# EAGLE design Narrow AAA sensor v1 (EAGLE 7.7.0)
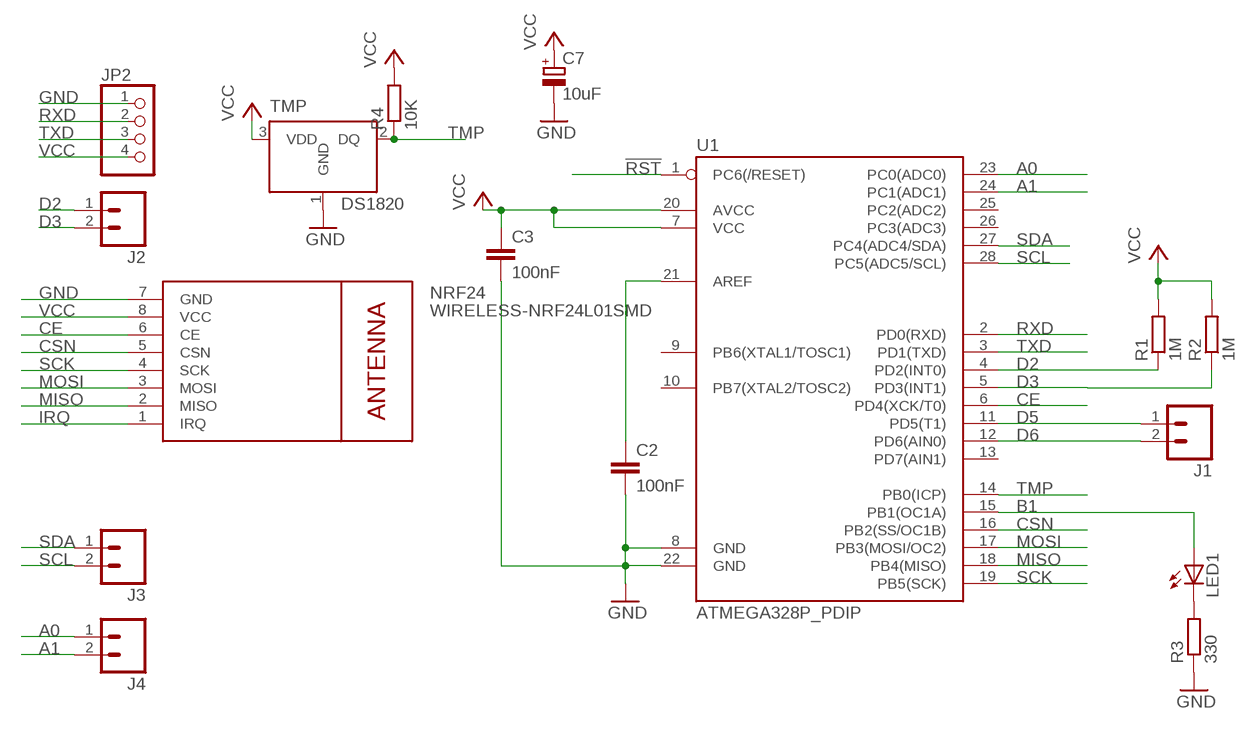
[diagram p0: schematic, sheet 1]

## Parts
C2  100nF  C-EU025-025X050  [C025-025X050]
C3  100nF  C-EU025-025X050  [C025-025X050]
C7  10uF  CPOL-EUE2.5-5  [E2,5-5]
J1  M02PTH  [1X02]
J2  M02PTH  [1X02]
J3  M021X02_NO_SILK  [1X02_NO_SILK]
J4  M021X02_NO_SILK  [1X02_NO_SILK]
JP2  PINHD-1X4  [1X04]
LED1  LED3MM  [LED3MM]
NRF24  WIRELESS-NRF24L01SMD  [WIRELESS-NRF24L01-SMD]
R1  1M  R-EU_0204/7  [0204/7]
R2  1M  R-EU_0204/7  [0204/7]
R3  330  R-EU_0204/7  [0204/7]
R4  10K  R-EU_0204/7  [0204/7]
TMP  DS1820  [TO-92]
U1  ATMEGA328P_PDIP  [DIL28-3]

## Nets
!RST: U1.1(PC6(/RESET))
A0: J4.1 U1.23(PC0(ADC0))
A1: J4.2 U1.24(PC1(ADC1))
B1: LED1.A U1.15(PB1(OC1A))
CE: NRF24.6(CE) U1.6(PD4(XCK/T0))
CSN: NRF24.5(CSN) U1.16(PB2(SS/OC1B))
D2: J2.1 R1.1 U1.4(PD2(INT0))
D3: J2.2 R2.1 U1.5(PD3(INT1))
D5: J1.1 U1.11(PD5(T1))
D6: J1.2 U1.12(PD6(AIN0))
GND [power]: C2.2 C3.2 C7.- JP2.1 NRF24.7(GND) R3.1 TMP.1(GND) U1.8(GND) U1.22(GND)
IRQ: NRF24.1(IRQ)
MISO: NRF24.2(MISO) U1.18(PB4(MISO))
MOSI: NRF24.3(MOSI) U1.17(PB3(MOSI/OC2))
N$1: LED1.K(C) R3.2
N$8: C2.1 U1.21(AREF)
RXD: JP2.2 U1.2(PD0(RXD))
SCK: NRF24.4(SCK) U1.19(PB5(SCK))
SCL: J3.2 U1.28(PC5(ADC5/SCL))
SDA: J3.1 U1.27(PC4(ADC4/SDA))
TMP: R4.1 TMP.2(DQ) U1.14(PB0(ICP))
TXD: JP2.3 U1.3(PD1(TXD))
VCC [power]: C3.1 C7.+ JP2.4 NRF24.8(VCC) R1.2 R2.2 R4.2 TMP.3(VDD) U1.7(VCC) U1.20(AVCC)
Unconnected: U1.9(PB6(XTAL1/TOSC1)) U1.10(PB7(XTAL2/TOSC2)) U1.13(PD7(AIN1)) U1.25(PC2(ADC2)) U1.26(PC3(ADC3))

## Library data of the parts
C2 C3 = GertSanders:C-EU: CAPACITOR, European symbol
C7 = rcl:CPOL-EU: POLARIZED CAPACITOR, European symbol
J1-J4 = SparkFun-Connectors:M02: Standard 2-pin 0.1" header. Use with - straight break away headers ( PRT-00116) - right angle break away headers (PRT-00553) - swiss pins (PRT-00743) - machine pins (PRT-00117) - female headers (PRT-00115) Molex polarized connector foot print use with: PRT-08233 with associated crimp pins and housings. 2.54_SCREWTERM for use with PRT-10571. 3.5mm Screw Terminal footprints for PRT-08084 5mm Screw Terminal footprints for use with PRT-08432
JP2 = GertSanders:PINHD-1X4: PIN HEADER
LED1 = adafruit:LED: LED OSRAM: - CHIPLED LG R971, LG N971, LY N971, LG Q971, LY Q971, LO R971, LY R971 LH N974, LH R974 LS Q976, LO Q976, LY Q976 LO Q996 - Hyper CHIPLED LW Q18S LB Q993, LB Q99A, LB R99A - SideLED LS A670, LO A670, LY A670, LG A670, LP A670 LB A673, LV A673, LT A673, LW A673 LH A674 LY A675 LS A676, LA A676, LO A676, LY A676, LW A676 LS A679, LY A679, LG A679 - Hyper Micro SIDELED® LS Y876, LA Y876, LO Y876, LY Y876 LT Y87S - SmartLED LW L88C, LW L88S LB L89C, LB L89S, LG L890 LS L89K, LO L89K, LY L89K LS L896, LA L896, LO L896, LY L896 - TOPLED LS T670, LO T670, LY T670, LG T670, LP T670 LSG T670, LSP T670, LSY T670, LOP T670, LYG T670 LG T671, LOG T671, LSG T671 LB T673, LV T673, LT T673, LW T673 LH T674 LS T676, LA T676, LO T676, LY T676, LB T676, LH T676, LSB T676, LW T676 LB T67C, LV T67C, LT T67C, LS T67K, LO T67K, LY T67K, LW E67C LS E67B, LA E67B, LO E67B, LY E67B, LB E67C, LV E67C, LT E67C LW T67C LS T679, LY T679, LG T679 LS T770, LO T770, LY T770, LG T770, LP T770 LB T773, LV T773, LT T773, LW T773 LH T774 LS E675, LA E675, LY E675, LS T675 LS T776, LA T776, LO T776, LY T776, LB T776 LHGB T686 LT T68C, LB T68C - Hyper Mini TOPLED® LB M676 - Mini TOPLED Santana® LG M470 LS M47K, LO M47K, LY M47K Source: http://www.osram.convergy.de/
NRF24 = GertSanders:WIRELESS-NRF24L01: 2.4 GHz Wireless Module based on NRF24L01 chip
R1-R4 = rcl:R-EU_: RESISTOR, European symbol
TMP = DS1820:DS1820: DS1820 - 1-Wire Digital Thermometer
U1 = GertSanders:ATMEGA328P_PDIP: uC used in the Arduino 32kb flash, 1k EEPROM, 2k SRAM This is the through-hole version of this chip.

## Net classes
1 power: width 0.356 mm, clearance 0.178 mm

## Board
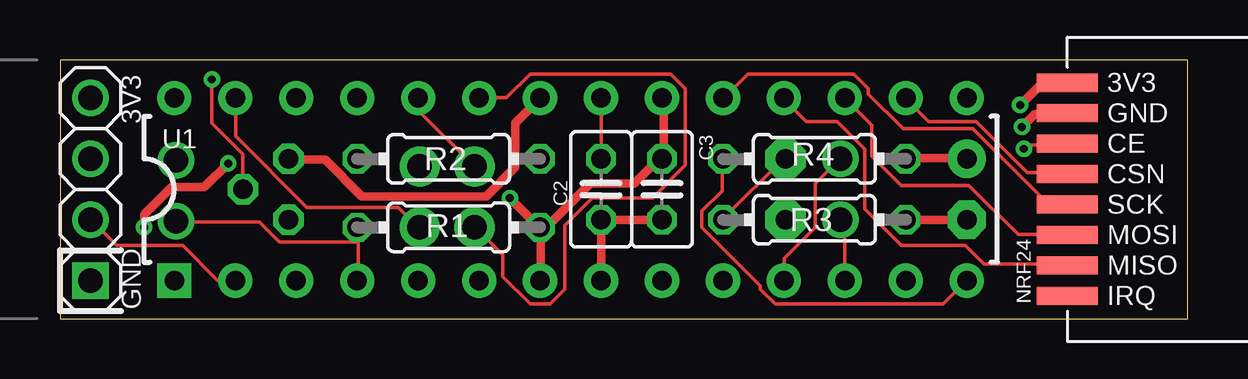
[diagram p1: board, top side]
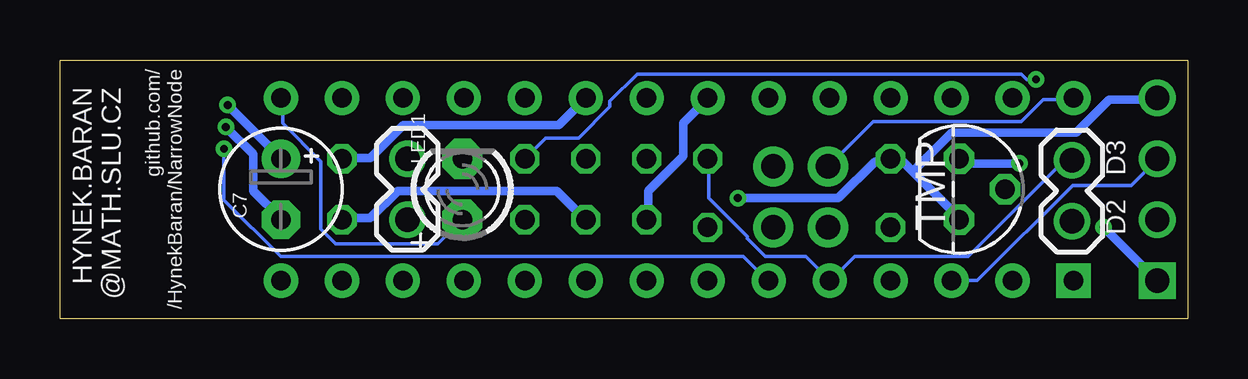
[diagram p2: board, bottom side, seen from below]

Size 46.99 x 10.79 mm. Coordinates in mm from the lower left corner, seen from the top.
Outline: 0,0 46.99,0 46.99,10.79 0,10.79 0,0
Copper layers (1*16): Top 0.0356mm / dielectric 1.5011mm / Bottom 0.0356mm
Design rules "oshpark-2layer": minimum track width 6mil, minimum drill 13mil, track to track 6mil, track to pad 6mil, pad to pad 6mil, via to via 6mil, smd to smd 6mil, copper to edge 15mil, drill to drill 6mil, minimum pad ring 7mil, minimum via ring 7mil, stop-mask expansion 2.5mil, vias tented up to drill 0mil, thermal gap 10mil

### Footprints (pad centres in the part's own frame; a part is rotated, then mirrored left to right if it is on the bottom)
C025-025X050 = drill 0.813 octagon: 1 -1.27,0; 2 1.27,0
E2,5-5 = drill 0.813 pad 1.6: + -1.27,0 | drill 0.813 pad 1.6 octagon: - 1.27,0
1X02 = drill 1.016 pad 1.422: 1 0,0; 2 2.54,0
1X02_NO_SILK = drill 1.016 pad 1.676: 1 0,0; 2 2.54,0
1X04 = drill 1.016 square: 1 -3.81,0 | drill 1.016: 2 -1.27,0; 3 1.27,0; 4 3.81,0
LED3MM = drill 0.813 pad 1.676 octagon: A -1.27,0; K 1.27,0
WIRELESS-NRF24L01-SMD = smd 2.54 x 0.762: 1 1.27,0; 2 1.27,1.27; 3 1.27,2.54; 4 1.27,3.81; 5 1.27,5.08; 6 1.27,6.35; 7 1.27,7.62; 8 1.27,8.89
0204/7 = drill 0.813 octagon: 1 -3.81,0; 2 3.81,0
TO-92 = drill 0.813 pad 1.27 octagon: 1 -1.27,0; 2 0,1.905; 3 1.27,0
DIL28-3 = drill 0.813 pad 1.422 square: 1 -16.51,-3.81 | drill 0.813 pad 1.422: 2 -13.97,-3.81; 3 -11.43,-3.81; 4 -8.89,-3.81; 5 -6.35,-3.81; 6 -3.81,-3.81; 7 -1.27,-3.81; 8 1.27,-3.81; 9 3.81,-3.81; 10 6.35,-3.81; 11 8.89,-3.81; 12 11.43,-3.81; 13 13.97,-3.81; 14 16.51,-3.81; 15 16.51,3.81; 16 13.97,3.81; 17 11.43,3.81; 18 8.89,3.81; 19 6.35,3.81; 20 3.81,3.81; 21 1.27,3.81; 22 -1.27,3.81; 23 -3.81,3.81; 24 -6.35,3.81; 25 -8.89,3.81; 26 -11.43,3.81; 27 -13.97,3.81; 28 -16.51,3.81

### Placement (x,y rotation side)
C2  22.54,5.4 270 top
C3  25.08,5.4 270 top
C7  37.78,5.4 270 bottom
J1  32.51,6.67 270 bottom
J2  4.83,4.06 90 bottom
J3  14.99,3.81 90 top
J4  17.27,3.81 90 top
JP2  1.27,5.4 90 top
LED1  30.23,5.4 90 bottom
NRF24  40.7,0.95 0 top
R1  16.19,3.81 0 top
R2  16.19,6.67 180 top
R3  31.43,4.13 180 top
R4  31.43,6.67 0 top
TMP  9.53,5.4 270 bottom
U1  21.27,5.4 0 top

### Tracks (layer width: path | path; a pad name or v marks a point on that pad's centre or on a via)
A0
  Top 0.152: U1.23 17.53,9.22 18.59,9.22 19.58,10.21 25.45,10.21 26.06,9.6 26.06,6.4 24.69,5.03 22.17,5.03 21.03,3.89 21.03,1.22 20.42,0.61 19.58,0.61 18.44,1.75 18.44,2.67 17.3,3.81 J4.1
A1
  Top 0.152: J4.2 14.94,8.69 14.94,9.14 U1.24
B1
  Bottom 0.152: U1.15 37.72,9.14 37.72,8.15 36.12,6.55 36.12,3.73 35.51,3.12 31.24,3.12 30.25,4.12 LED1.A
CE  (via drill 0.33)
  Top 0.152: v40.16,7.09 40.31,7.24 41.91,7.24 NRF24.6
  Bottom 0.152: v40.16,7.09 40.16,4.95 37.8,2.59 18.52,2.59 17.53,1.6 U1.6
CSN
  Top 0.152: NRF24.5 41.91,6.1 40.31,6.1 38.18,8.23 36.2,8.23 35.28,9.14 U1.16
D2
  Top 0.152: 12.42,3.2 12.42,1.6 U1.4 | 12.42,3.2 12.42,3.81 R1.1 | 12.42,3.2 9.14,3.2 8.31,4.04 4.88,4.04 J2.1
D3
  Bottom 0.152: R2.1 19.96,6.63 19.96,5.03 18.36,3.43 18.36,3.35 17.6,2.59 15.93,2.59 U1.5 14.86,1.6 13.87,2.59 9.14,2.59 5.18,6.55 4.88,6.55 J2.2
D5
  Top 0.152: U1.11 30.18,1.6 30.18,2.52 31.47,3.81 31.47,5.64 32.46,6.63 J1.1
D6
  Top 0.152: U1.12 32.69,3.96 32.54,4.12 J1.2
GND  (via drill 0.33)
  Top 0.356: R3.1 35.28,4.12 37.72,4.12 C7.- | v40.08,8 40.62,8.53 41.91,8.53 NRF24.7 | C3.2 25.07,4.12 22.55,4.12 C2.2 22.55,3.96 22.55,1.6 U1.8 | TMP.1 9.53,6.63 11.05,6.63 12.57,5.11 17.75,5.11 18.97,6.33 18.97,8.15 19.96,9.14 U1.22 | v3.5,3.81 3.5,4.34 4.65,5.49 6.02,5.49 v7.01,6.48
  Bottom 0.356: v40.08,8 38.94,6.86 38.94,5.33 37.8,4.19 C7.- | v3.5,3.81 1.29,1.6 JP2.1 | v7.01,6.48 9.37,6.48 9.53,6.63 TMP.1 | C2.2 22.48,4.19 22.48,5.33 21.03,6.78 21.03,8.15 20.04,9.14 U1.22 | C3.2 26.29,5.33 32.92,5.33 34.06,4.19 35.2,4.19 R3.1
MISO
  Top 0.152: NRF24.2 41.91,2.29 38.48,2.29 37.72,3.05 35.05,3.05 33.53,4.57 33.53,7.09 32.38,8.23 31.09,8.23 30.18,9.14 U1.18
MOSI
  Top 0.152: U1.17 33.83,8.08 33.83,6.78 35.05,5.56 37.87,5.56 39.93,3.5 41.91,3.5 NRF24.3
N$1
  Top 0.152: R3.2 27.66,4.19 30.18,6.71 LED1.K
N$8
  Top 0.152: C2.1 22.55,6.71 22.55,9.14 U1.21
RXD
  Top 0.152: U1.2 7.24,1.6 6.55,1.6 5.11,3.05 2.36,3.05 1.29,4.12 JP2.2
SCK
  Top 0.152: NRF24.4 41.91,4.8 41.15,4.8 38.02,7.92 35.13,7.92 33.68,9.37 33.68,9.6 33.07,10.21 28.65,10.21 27.66,9.22 U1.19
SCL
  Bottom 0.152: J3.2 13.11,8.23 6.93,8.23 6.02,9.14 4.8,9.14 U1.28
SDA
  Top 0.152: U1.27 7.32,9.14 7.32,7.62 10.29,4.65 14.1,4.65 14.94,3.81 J3.1
TMP  (via drill 0.33)
  Top 0.152: U1.14 36.8,0.61 29.79,0.61 29.18,1.22 29.18,1.37 26.75,3.81 26.75,4.5 27.58,5.33 27.58,6.63 R4.1 | TMP.2 7.62,6.86 6.33,8.15 v6.33,9.98
  Bottom 0.152: v6.33,9.98 6.71,9.98 6.93,10.21 22.94,10.21 24.08,9.07 24.08,8.84 25.38,7.54 26.75,7.54 R4.1
TXD
  Bottom 0.152: U1.3 8.76,1.6 4.8,5.56 2.36,5.56 1.29,6.63 JP2.3
VCC  (via drill 0.33)
  Top 0.356: R4.2 35.28,6.71 37.72,6.71 C7.+ | v40.01,8.91 40.92,9.83 41.91,9.83 NRF24.8 | R1.2 20.04,3.81 20.04,1.6 U1.7 | U1.20 25.15,9.14 25.15,6.71 C3.1 24.92,6.63 23.93,5.64 22.1,5.64 20.34,3.89 20.19,3.89 R1.2 | v18.75,5.03 19.89,3.89 R1.2
  Bottom 0.356: 11.47,6.13 9.53,4.19 TMP.3 | 11.47,6.13 11.96,6.63 12.34,6.63 R2.2 12.5,6.55 13.03,6.55 14.55,5.03 v18.75,5.03 | 11.47,6.13 9.83,7.77 4.65,7.77 3.28,9.14 1.29,9.14 JP2.4 | v40.01,8.91 37.8,6.71 C7.+ | U1.20 26.21,8.08 32.69,8.08 34.06,6.71 35.2,6.71 R4.2

### Text on the board
tPlace: 3V3 | GND
bPlace: D3 | D2
bNames: github.com/ / /HynekBaran/NarrowNode | HYNEK.BARAN / @MATH.SLU.CZ